# Altium schematic sheet mcu.SchDoc
size A3; SheetNumber: 5; SheetTotal: 11
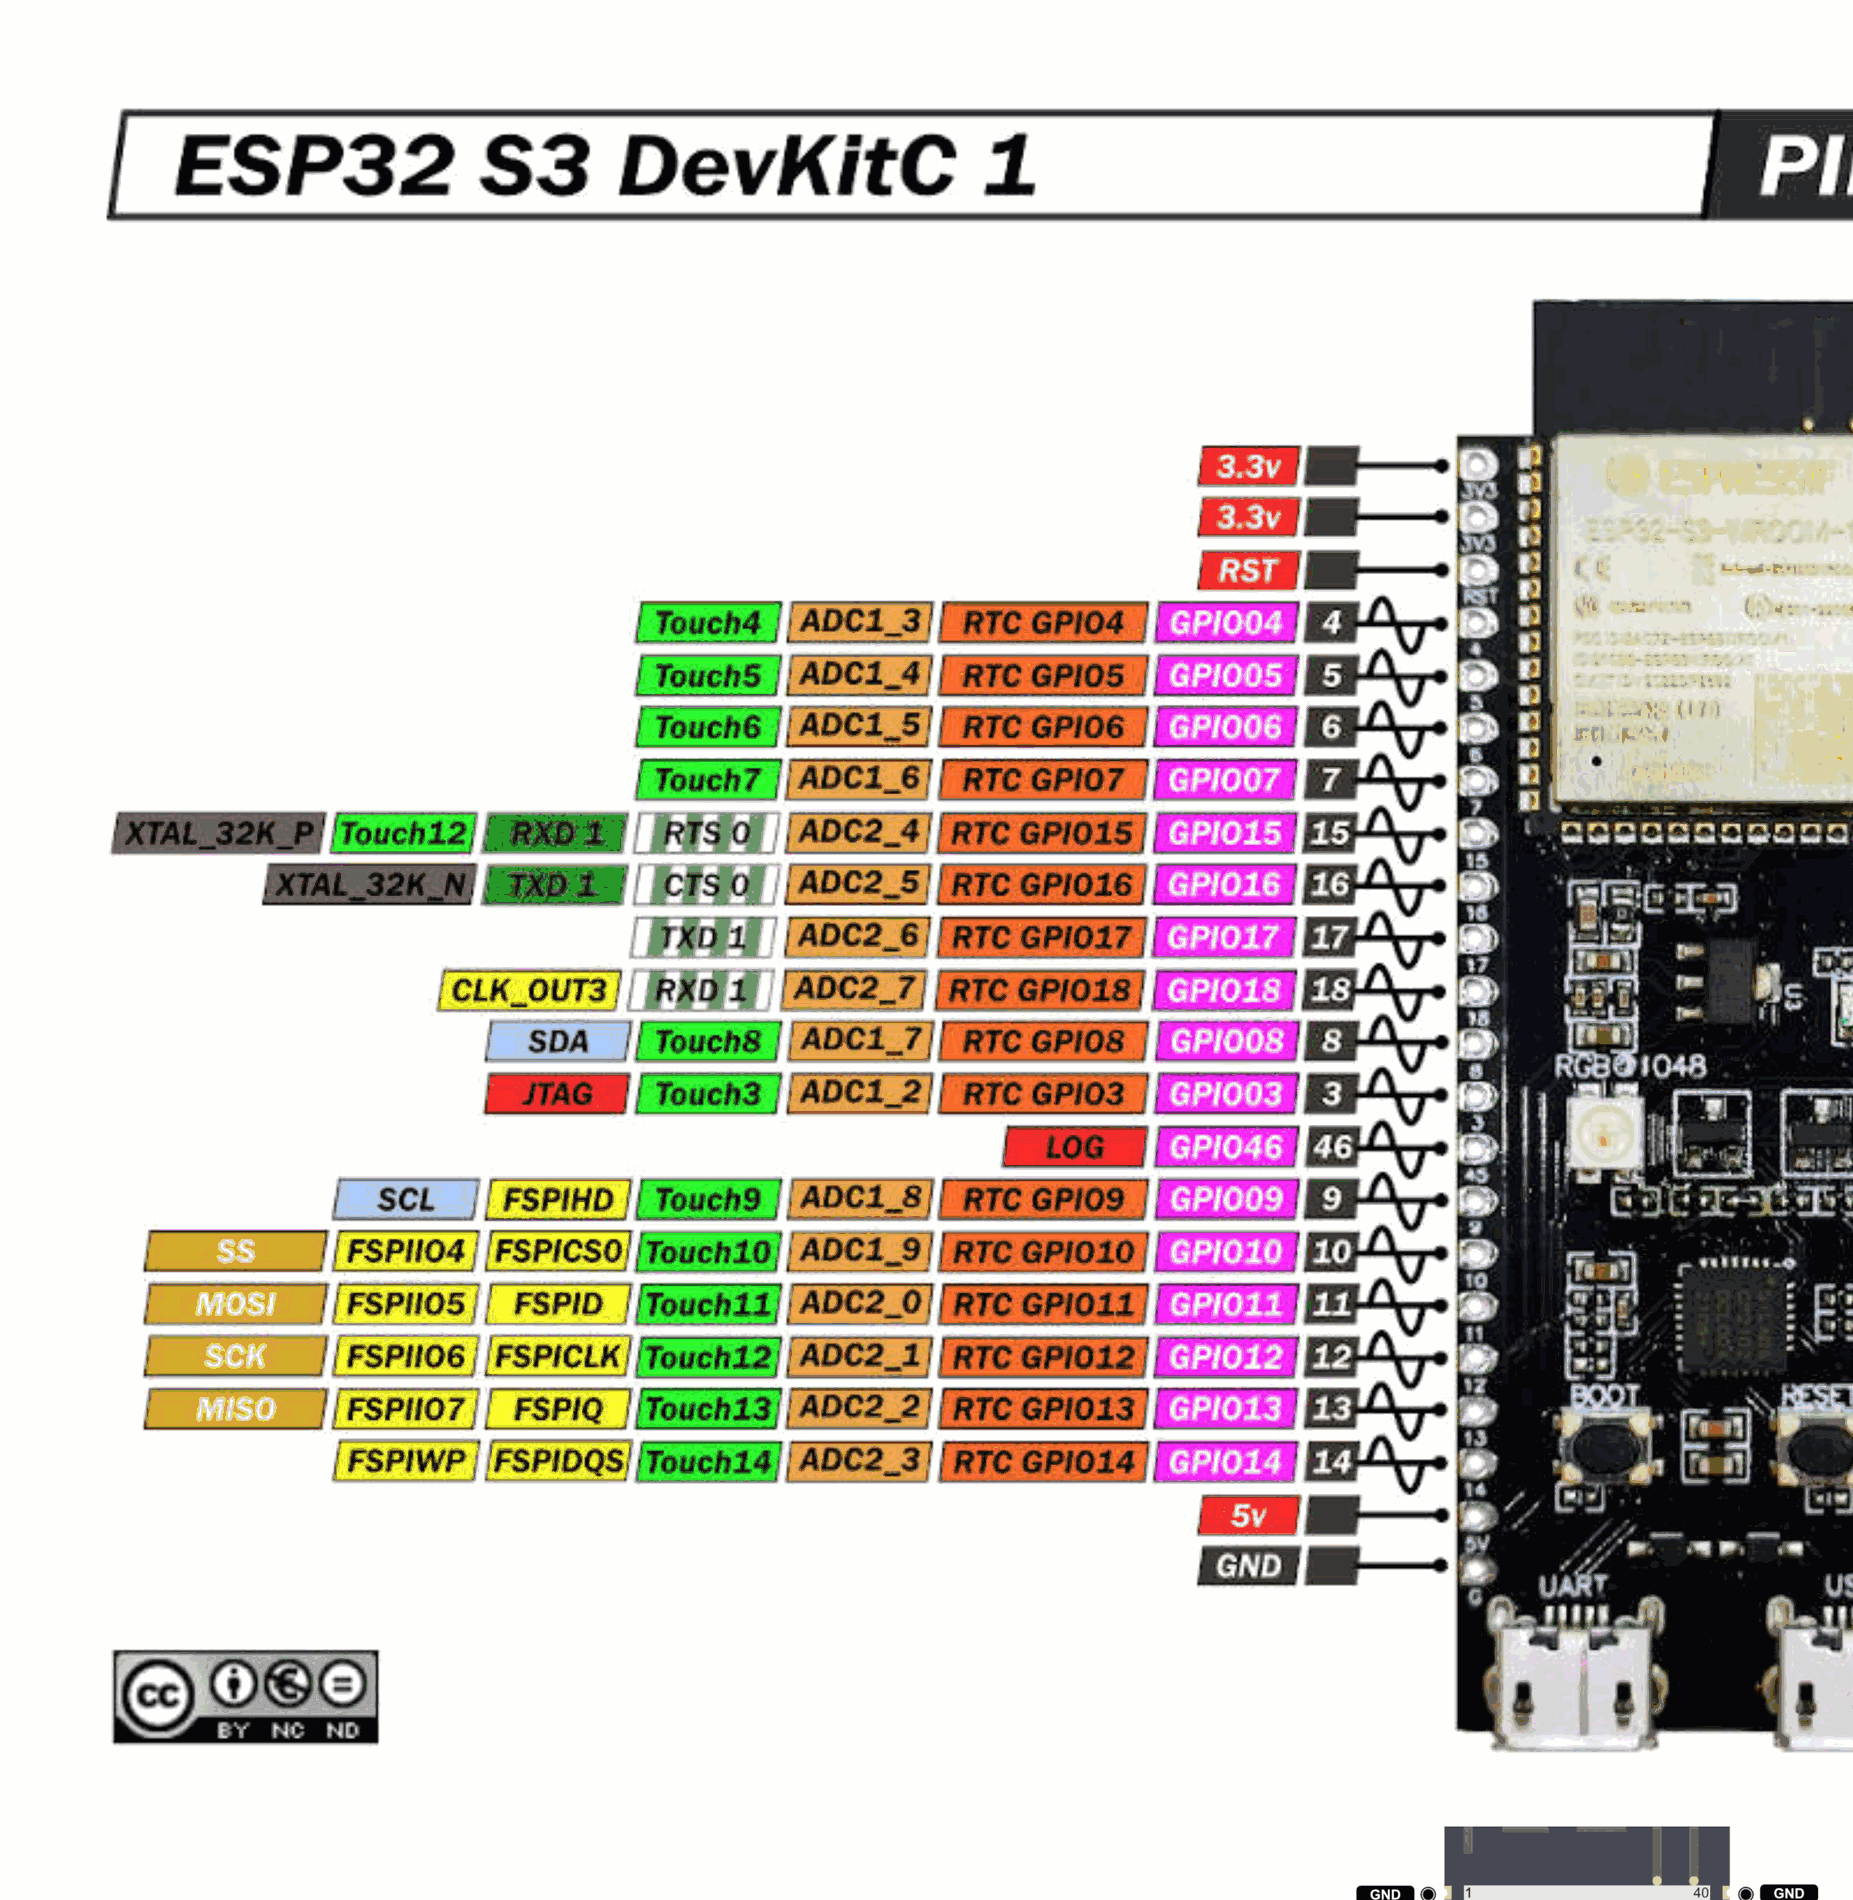
[diagram p0: mcu.SchDoc, top left]
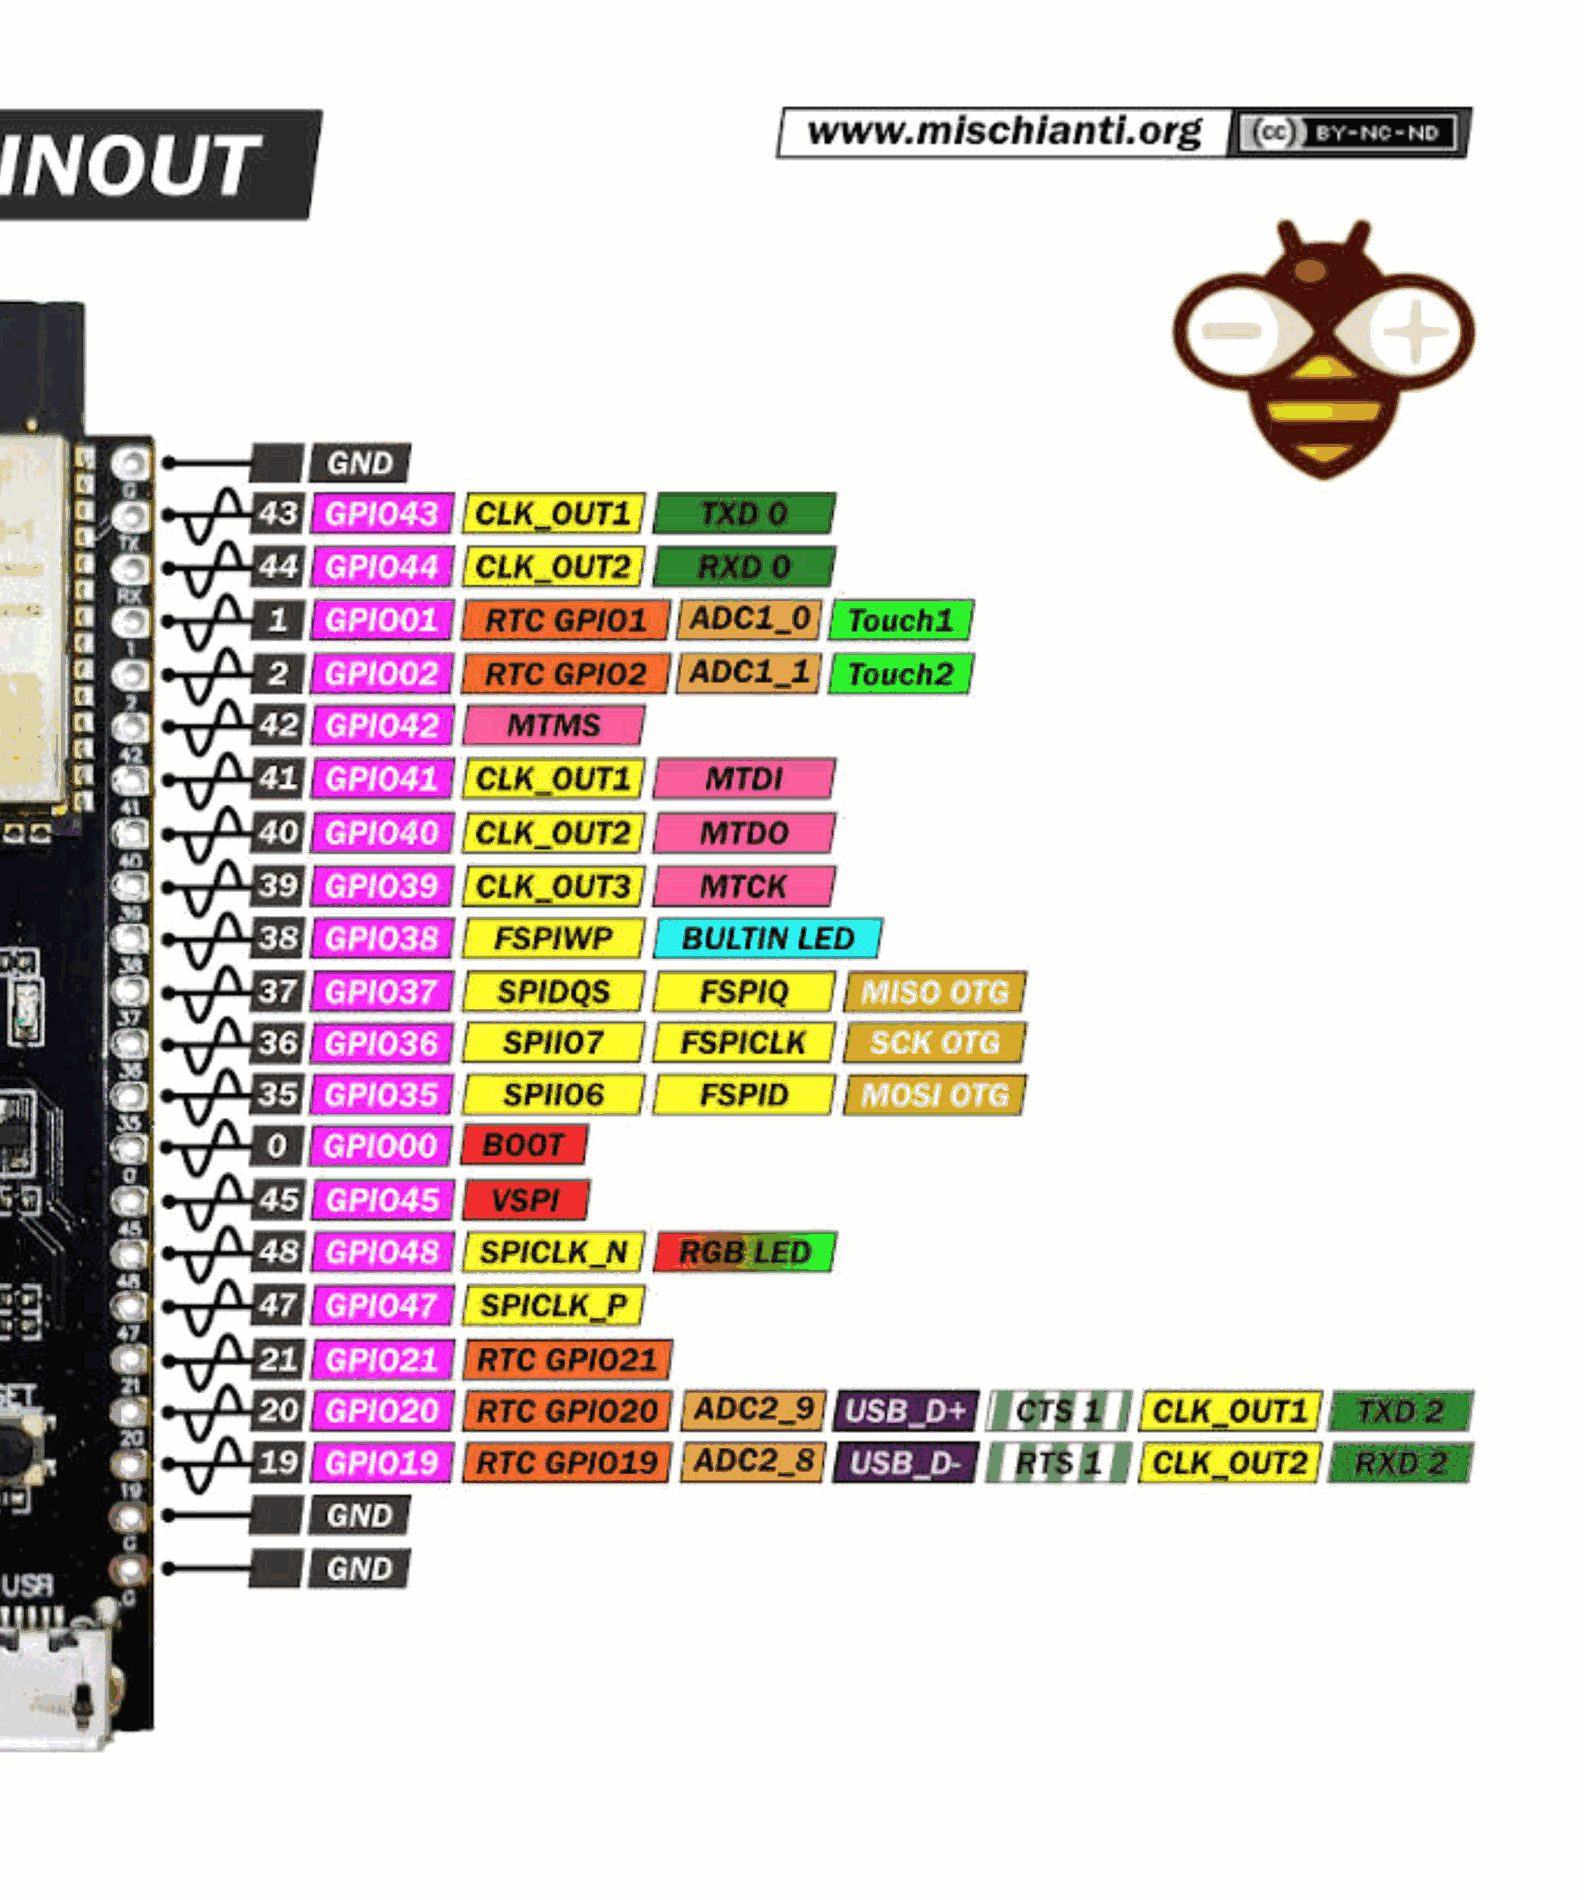
[diagram p1: mcu.SchDoc, top right]
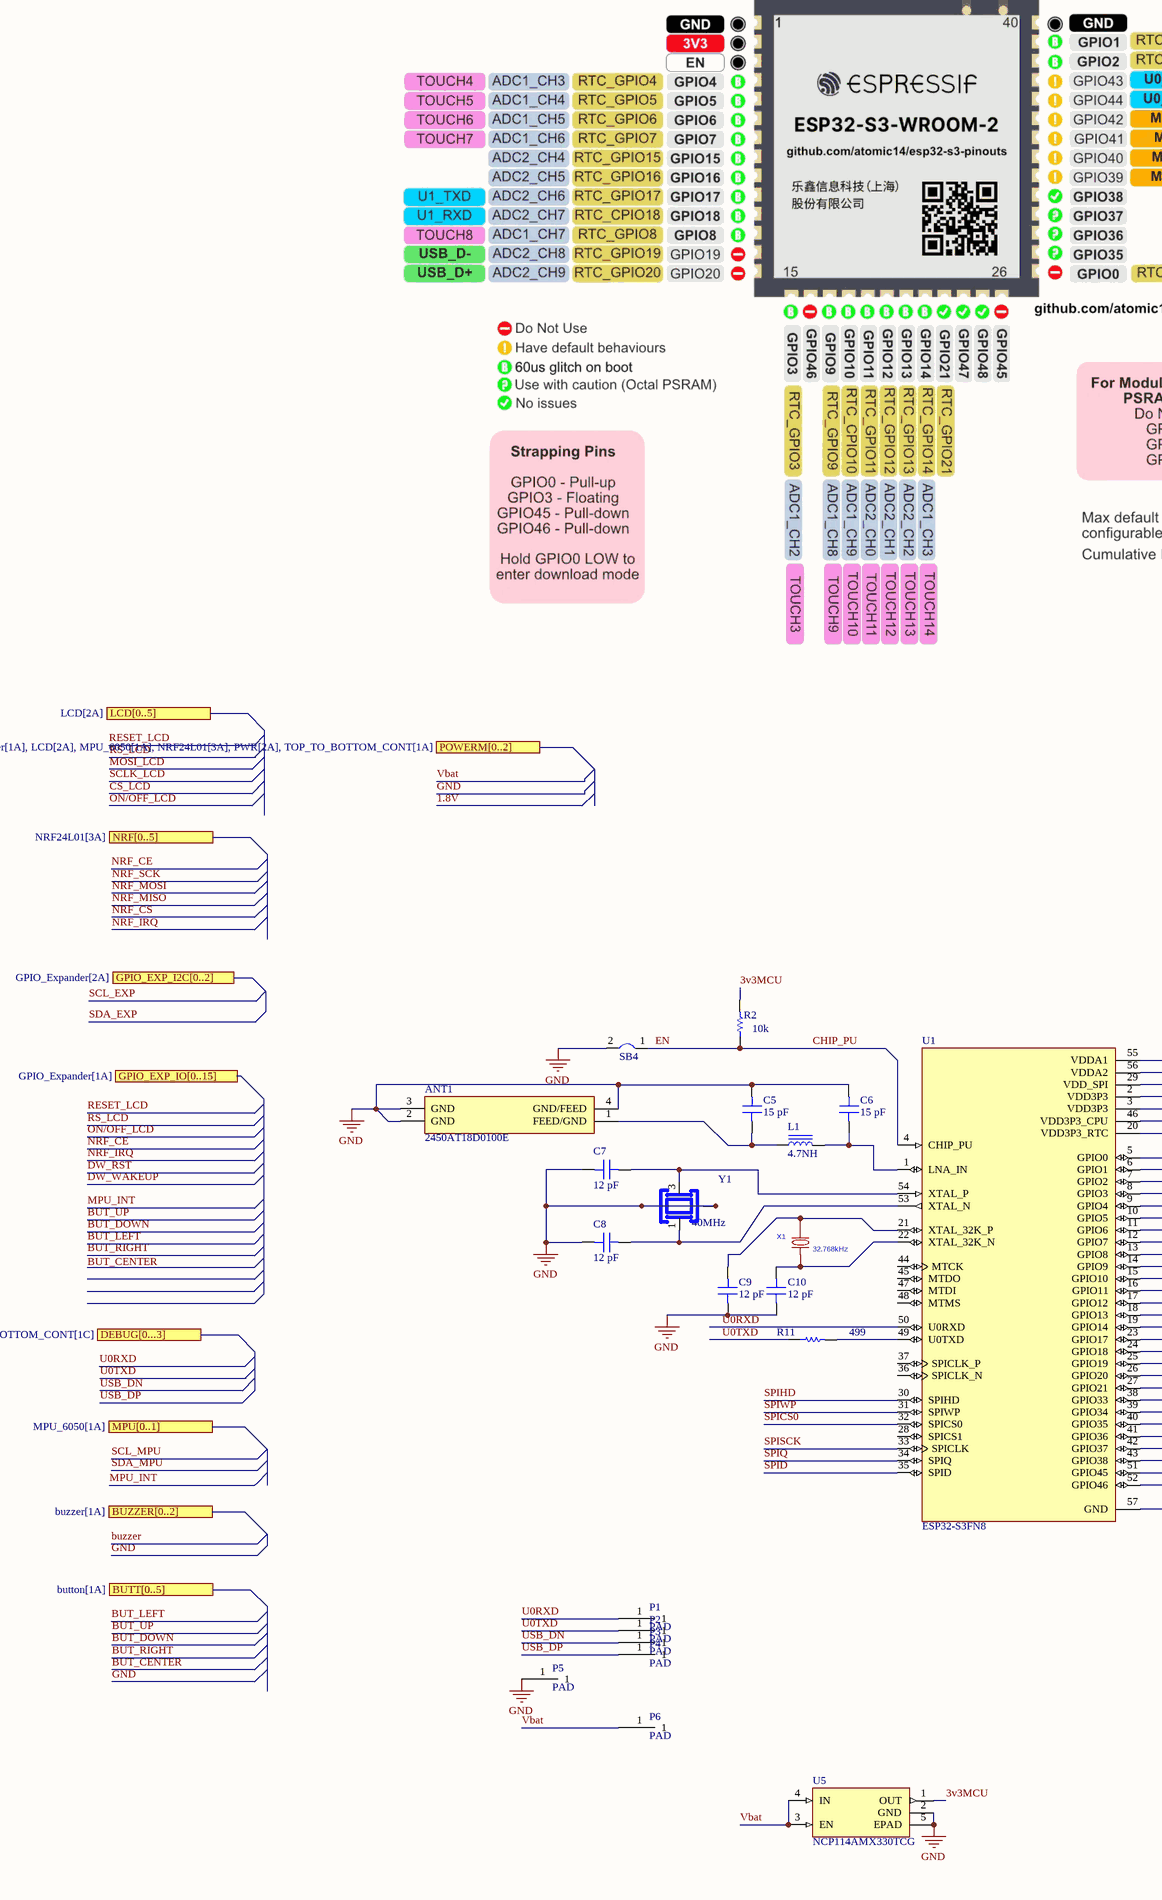
[diagram p2: mcu.SchDoc, bottom left]
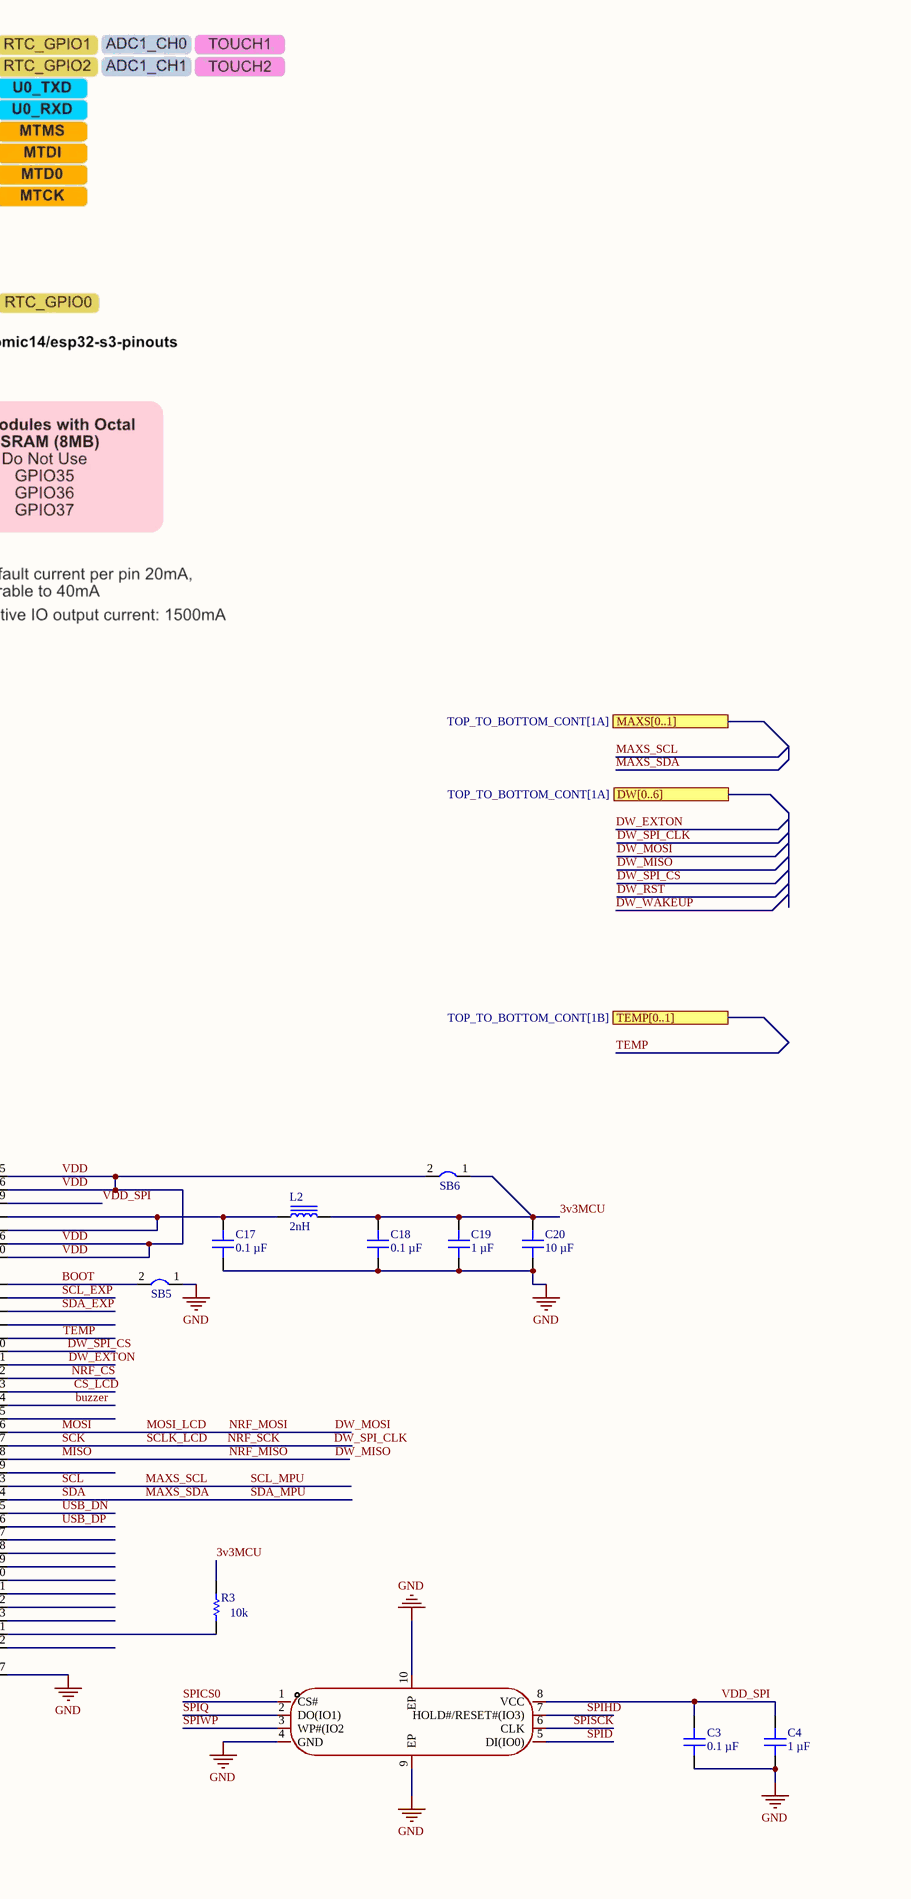
[diagram p3: mcu.SchDoc, bottom right]

## Parts
ANT1  2450AT18D0100E  [FP-2450AT18D0100E-MFG]
C3  Capacitance: 0.1 µF  [CAP 0402_1005]
C4  Capacitance: 1 µF  [CAP 0402_1005]
C5  Capacitance: 15 pF  [CAP 0402_1005]
C6  Capacitance: 15 pF  [CAP 0402_1005]
C7  Capacitance: 12 pF  [CAP 0402_1005]
C8  Capacitance: 12 pF  [CAP 0402_1005]
C9  Capacitance: 12 pF  [CAP 0402_1005]
C10  Capacitance: 12 pF  [CAP 0402_1005]
C17  Capacitance: 0.1 µF  [CAP 0402_1005]
C18  Capacitance: 0.1 µF  [CAP 0402_1005]
C19  Capacitance: 1 µF  [CAP 0402_1005]
C20  Capacitance: 10 µF  [CAP 0402_1005]
L1  4.7NH  [Murata LQG15 0402]
L2  2nH  [IND 0402_1005]
P1  PAD  [PCBComponent_1]
P2  PAD  [PCBComponent_1]
P3  PAD  [PCBComponent_1]
P4  PAD  [PCBComponent_1]
P5  PAD  [PCBComponent_1]
P6  PAD  [PCBComponent_1]
R2  resistance: 10k  [RESC1005X40X25LL05T10]  (hidden comment: 0402WGF1002TCE)
R3  resistance: 10k  [RESC1005X40X25LL05T10]  (hidden comment: 0402WGF1002TCE)
R11  resistance: 499  [RESC1005X40X20LL05T10]  (hidden comment: TNPW0402499RBEED)
SB4  Jumper  [Jumper]  (value not drawn)
SB5  Jumper  [Jumper]  (value not drawn)
SB6  Jumper  [Jumper]  (value not drawn)
U1  ESP32-S3FN8  [QFN40P700X700X90-57N]
U3  W25Q64JWUUIQ  [USON-8_L4.0-W3.0-P0.80-BL_WINBOND_UU]  (value not drawn)
U5  NCP114AMX330TCG  [REG_NCP114AMX330TCG]
X1  32.768kHz  [FC-135R_L3.2-W1.5]
Y1  value 40MHz  [C5261125]  (hidden comment: L225S400L11L)

## Ports
BUTT[0..5] (see button[1A]), BUZZER[0..2] (see buzzer[1A]), DEBUG[0...3] (see TOP_TO_BOTTOM_CONT[1C]), DW[0..6] (see TOP_TO_BOTTOM_CONT[1A]), GPIO_EXP_I2C[0..2] (see GPIO_Expander[2A]), GPIO_EXP_IO[0..15] (see GPIO_Expander[1A]), LCD[0..5] (see LCD[2A]), MAXS[0..1] (see TOP_TO_BOTTOM_CONT[1A]), MPU[0..1] (see MPU_6050[1A]), NRF[0..5] (see NRF24L01[3A]), POWERM[0..2] (see GPIO_Expander[1A], LCD[2A], MPU_6050[1A], NRF24L01[3A], PWR[2A], TOP_TO_BOTTOM_CONT[1A]), TEMP[0..1] (see TOP_TO_BOTTOM_CONT[1B])

## Nets
GND: ANT1.2(GND) ANT1.3(GND) ANT1.4(GND/FEED) C3.1 C4.1 C5.2 C6.2 C7.1 C8.1 C9.2 C10.2 C17.1 C18.1 C19.1 C20.1 P5.1 SB4.2 SB5.1 U1.57(GND) U3.4(GND) U3.9(EP) U3.10(EP) U5.2(GND) U5.5(EPAD) Y1.2(GND) Y1.4(GND)
3v3MCU: C18.2 C19.2 C20.2 L2.2 R2.2 R3.2 SB6.1 U5.1(OUT)
BOOT: SB5.2 U1.5(GPIO0)
buzzer: U1.14(GPIO9)
CHIP_PU: R2.1 SB4.1 U1.4(CHIP_PU)  [also labelled EN]
CS_LCD: U1.13(GPIO8)
DW_EXTON: U1.11(GPIO6)
DW_MISO: U1.18(GPIO13)  [also labelled MISO, NRF_MISO]
DW_MOSI: U1.16(GPIO11)  [also labelled MOSI, MOSI_LCD, NRF_MOSI]
DW_SPI_CLK: U1.17(GPIO12)  [also labelled NRF_SCK, SCK, SCLK_LCD]
DW_SPI_CS: U1.10(GPIO5)
MAXS_SCL: U1.23(GPIO17)  [also labelled SCL, SCL_MPU]
MAXS_SDA: U1.24(GPIO18)  [also labelled SDA, SDA_MPU]
NRF_CS: U1.12(GPIO7)
SCL_EXP: U1.6(GPIO1)
SDA_EXP: U1.7(GPIO2)
SPICS0: U1.32(SPICS0) U3.1(CS#)
SPID: U1.35(SPID) U3.5(DI(IO0))
SPIHD: U1.30(SPIHD) U3.7(HOLD#/RESET#(IO3))
SPIQ: U1.34(SPIQ) U3.2(DO(IO1))
SPISCK: U1.33(SPICLK) U3.6(CLK)
SPIWP: U1.31(SPIWP) U3.3(WP#(IO2)
TEMP: U1.9(GPIO4)
U0RXD: P1.1 U1.50(U0RXD)
U0TXD: P2.1 R11.1
USB_DN: P3.1 U1.25(GPIO19)
USB_DP: P4.1 U1.26(GPIO20)
Vbat: P6.1 U5.3(EN) U5.4(IN)
VDD: SB6.2 U1.20(VDD3P3_RTC) U1.46(VDD3P3_CPU) U1.55(VDDA1) U1.56(VDDA2)
VDD_SPI: C3.2 C4.2 U1.29(VDD_SPI) U3.8(VCC)
NetANT1_1: ANT1.1(FEED/GND) C5.1 L1.1
NetC6_1: C6.1 L1.2 U1.1(LNA_IN)
NetC7_2: C7.2 U1.54(XTAL_P) Y1.3(OUT/IN)
NetC8_2: C8.2 U1.53(XTAL_N) Y1.1(IN/OUT)
NetC9_1: C9.1 U1.21(XTAL_32K_P) X1.2
NetC10_1: C10.1 U1.22(XTAL_32K_N) X1.1
NetC17_2: C17.2 L2.1 U1.2(VDD3P3) U1.3(VDD3P3)
NetR3_1: R3.1 U1.51(GPIO45)
NetR11_2: R11.2 U1.49(U0TXD)

Not connected (* = marked no-connect by the designer): U1 8(GPIO3) 15(GPIO10) 19(GPIO14) 27(GPIO21) 28(SPICS1) 36(SPICLK_N) 37(SPICLK_P) 38(GPIO33) 39(GPIO34) 40(GPIO35) 41(GPIO36) 42(GPIO37) 43(GPIO38) 44(MTCK) 45(MTDO) 47(MTDI) 48(MTMS) 52(GPIO46)

## Notes on the sheet
- Labels drawn without touching a wire or pin: BUT_CENTER

## Library data of the parts
ANT1 = CMP-2000-05543-2: RF ANT 2.4GHZ CHIP SOLDER SMD; Manufacturer: Johanson Dielectrics; JLCPCB Part #: C2917718; MFR.Part #: 2450AT18D0100E
C3 C17 C18 = 0402B104J160CT: 100nF 16V X7R ±10% 0402 Multilayer Ceramic Capacitors MLCC - SMD/SMT ROHS; Manufacturer: YAGEO; MFR.Part #: CC0402KRX7R7BB104; JLCPCB Part #: C60474
  C3: Device Package: 0402 (1005 Metric); Size / Dimension: 0.039" L x 0.020" W (1.00mm x 0.50mm)
C4 = 0402DD105KAT2A: 10V 1uF X5R ±10% 0402 Multilayer Ceramic Capacitors MLCC - SMD/SMT ROHS; Part Number: CL05A105KP5NNNC; Manufacturer: Samsung Electro-Mechanics; Device Package: 0402 (1005 Metric); Size / Dimension: 0.039" L x 0.020" W (1.00mm x 0.50mm); MFR.Part #: CL05A105KP5NNNC; JLCPCB Part #: C14445
C5 C6 = 201R07S150GV4T: CAP CER 15PF 200V C0G/NP0 0402; Manufacturer: FH (Guangdong Fenghua Advanced Tech); MFR.Part #: 0402CG150J500NT; JLCPCB Part #: C1548
  C6: Applications: RF, Microwave, High Frequency
C7-C9 = 201R07S120GV4T: CAP CER 12PF 200V C0G/NP0 0402; Manufacturer: FH (Guangdong Fenghua Advanced Tech); MFR.Part #: 0402CG120J500NT; JLCPCB Part #: C1547
C10 = 201R07S120GV4T: CAP CER 12PF 200V C0G/NP0 0402; Part Number: 0402CG120J500NT; Manufacturer: FH (Guangdong Fenghua Advanced Tech); Device Package: 0402 (1005 Metric); Mounting Type: Surface Mount, MLCC; Size / Dimension: 0.040" L x 0.020" W (1.02mm x 0.51mm); MFR.Part #: 0402CG120J500NT; JLCPCB Part #: C1547
C19 = 0402DD105KAT2A: 10V 1uF X5R ±10% 0402 Multilayer Ceramic Capacitors MLCC - SMD/SMT ROHS; Manufacturer: Samsung Electro-Mechanics; MFR.Part #: CL05A105KP5NNNC; JLCPCB Part #: C14445
C20 = 0402DD105KAT2A: 10V 1uF X5R ±10% 0402 Multilayer Ceramic Capacitors MLCC - SMD/SMT ROHS; Manufacturer: Samsung Electro-Mechanics; MFR.Part #: CL05A106MQ5NUNC; JLCPCB Part #: C15525
L1 = LQG15HN4N7B02D: 200mΩ 300mA 4.7nH 4GHz 8@100MHz 0402 Inductors (SMD) ROHS; Manufacturer: Sunlord; MFR.Part #: SDCL1005C4N7STDF; value: 4.7NH; JLCPCB Part #: C13595
L2 = HLC022R0BTTR: FIXED IND 2NH 596MA 180 MOHM SMD; Manufacturer: AVX Corporation; MFR.Part #: W25Q64JWUUIQ; DC Resistance (DCR): 180mOhm Max; Frequency - Self Resonant: 17GHz; Inductance Frequency - Test: 450MHz; Material - Core: Non-Magnetic; Q @ Freq: 26 @ 450MHz; Shielding: Unshielded; Tolerance: ±0.1nH; Type: Multilayer; Part Number: HLC022R0BTTR; ComponentLink1Description: Datasheet; ComponentLink1URL: //media.digikey.com/pdf/Data%20Sheets/AVX%20PDFs/MLO%20High%20Current%20Inductors.pdf; ComponentLink2Description: DigiKey Link; ComponentLink2URL: http://digikey.com/product-detail/en/avx-corporation/HLC022R0BTTR/478-7195-1-ND/3528423; Current Rating (Amps): 596mA; Device Package: 0402 (1005 Metric); Height - Seated (Max): 0.018" (0.45mm); Inductance: 2nH; LastUpdated: 9/2/2020 1:24:25 AM; Lifecycle Status: Active; Minimum Order: 1; Mounting Type: Surface Mount; Operating Temperature: -55°C ~ 125°C; Package / Case: 0402 (1005 Metric); Packaging: TapeAndReel; PartId: 1747; Part Status: Active; Price: 0.14; Series: MLO™; Size / Dimension: 0.039" L x 0.023" W (1.00mm x 0.58mm); Supplier 1: DigiKey; Supplier Part Number 1: 478-7195-1-ND; Supplier Device Package: 0402 (1005 Metric); Value: 2nH; JLCPCB Part #: C6604692
R2 R3 = CMP-2002-03043-1: Manufacturer: UNI-ROYAL(Uniroyal Elec); JLCPCB Part #: C25744; MFR.Part #: 0402WGF1002TCE
R11 = CMP-2002-01693-1: Manufacturer: YAGEO; MFR.Part #: RC0402FR-07499RL; JLCPCB Part #: C137970
U1 = ESP32-S3FN8: Espressif Systems [ENGINEERING SAMPLES]SMD IC , Dual-Core MCU, Wi-Fi 2.4G & BLE 5.0 combo, 8 MB Octal SPI PSRAM, QFN 56-pin, 7*7 mm; Manufacturer: Espressif Systems; MFR.Part #: ESP32-S3FN8; JLCPCB Part #: C2913196
U3 = W25Q64JWUUIQ: Manufacturer: Winbond Elec; JLCPCB Part #: C6604692; MFR.Part #: W25Q64JWUUIQ
U5 = NCP114AMX330TCG: Linear Voltage Regulator IC Positive Fixed 1 Output 300mA 4-UDFN (1.0x1.0); Manufacturer: onsemi; MFR.Part #: C133056; JLCPCB Part #: NCP114AMX330TCG
X1 = Q13FC13500004_C32346: Manufacturer: Seiko Epson; Value: 32.768kHz; MFR.Part #: Q13FC13500004; JLCPCB Part #: C32346
Y1 = L225S400L11L: -40℃~+85℃ 12pF 40MHz Crystal Oscillator ±10ppm SMD2520-4P Crystals ROHS; Manufacturer: Lucki; JLCPCB Part #: C5261125; MFR.Part #: L225S400L11L